# EAGLE design telekarte (EAGLE 6.3)
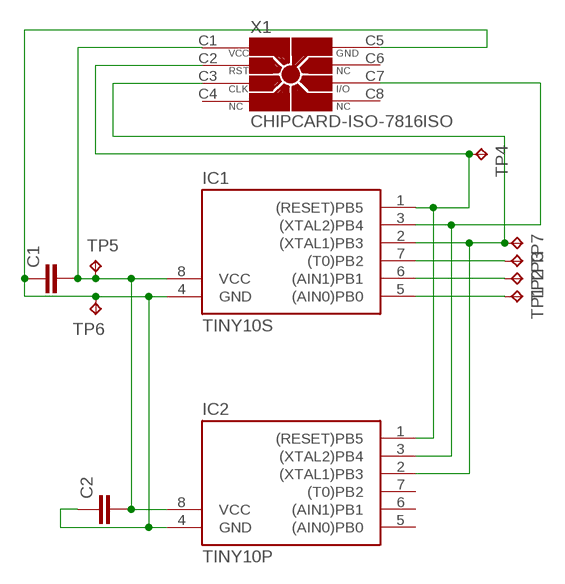
[diagram p0: schematic, sheet 1]

## Parts
C1  C-EUC0805  [C0805]
C2  C-EUC0805  [C0805]
IC1  TINY10S  [SO08]
IC2  TINY10P  [DIL08]
TP1  TPTP10SQ  [TP10SQ]
TP2  TPTP10SQ  [TP10SQ]
TP3  TPTP10SQ  [TP10SQ]
TP4  TPTP10SQ  [TP10SQ]
TP5  TPTP10SQ  [TP10SQ]
TP6  TPTP10SQ  [TP10SQ]
TP7  TPTP10SQ  [TP10SQ]
X1  CHIPCARD-ISO-7816ISO  [ISO-7816]

## Nets
CLK: IC1.2((XTAL1)PB3) IC2.2((XTAL1)PB3) TP7.TP X1.C3(CLK)
DAT: IC1.3((XTAL2)PB4) IC2.3((XTAL2)PB4) X1.C7(I/O)
GND: C1.1 C2.1 IC1.4(GND) IC2.4(GND) TP6.TP X1.C5(GND)
PB0: IC1.5((AIN0)PB0) TP1.TP
PB1: IC1.6((AIN1)PB1) TP2.TP
PB2: IC1.7((T0)PB2) TP3.TP
RST: IC1.1((RESET)PB5) IC2.1((RESET)PB5) TP4.TP X1.C2(RST)
VCC: C1.2 C2.2 IC1.8(VCC) IC2.8(VCC) TP5.TP X1.C1(VCC)
Unconnected: IC2.5((AIN0)PB0) IC2.6((AIN1)PB1) IC2.7((T0)PB2) X1.C4(NC) X1.C6(NC) X1.C8(NC)

## Library data of the parts
C1 C2 = resistor:C-EU: CAPACITOR, European symbol
IC1 IC2 = atmel:TINY10: MICROCONTROLLER 1 Kbytes ROM
TP1-TP7 = testpad:TP: Test pad
X1 = con-chipcard-iso7816:CHIPCARD-ISO-7816: Chip card connector ISO 7816; OC_FARNELL: unknown; OC_NEWARK: unknown

## Board
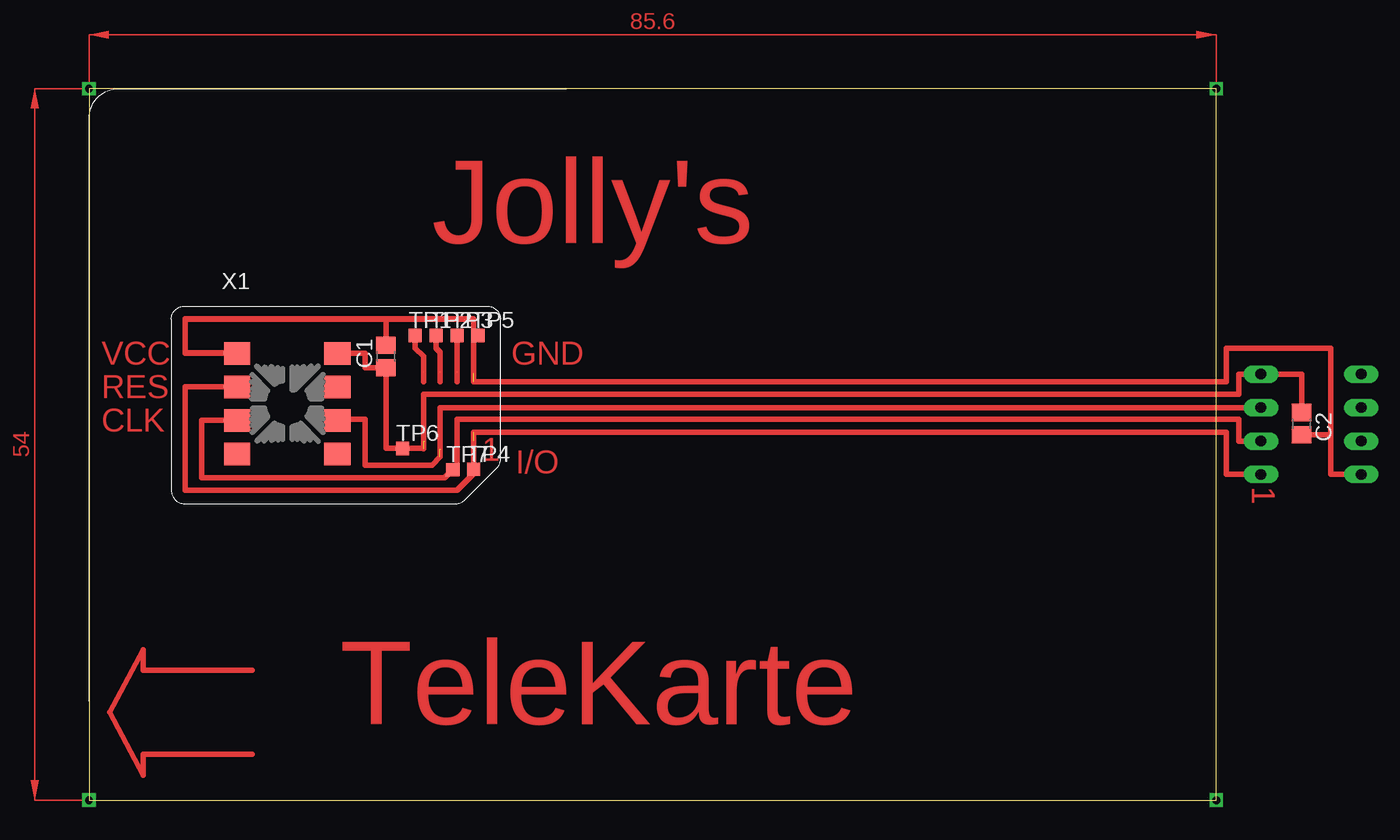
[diagram p1: board, top side]
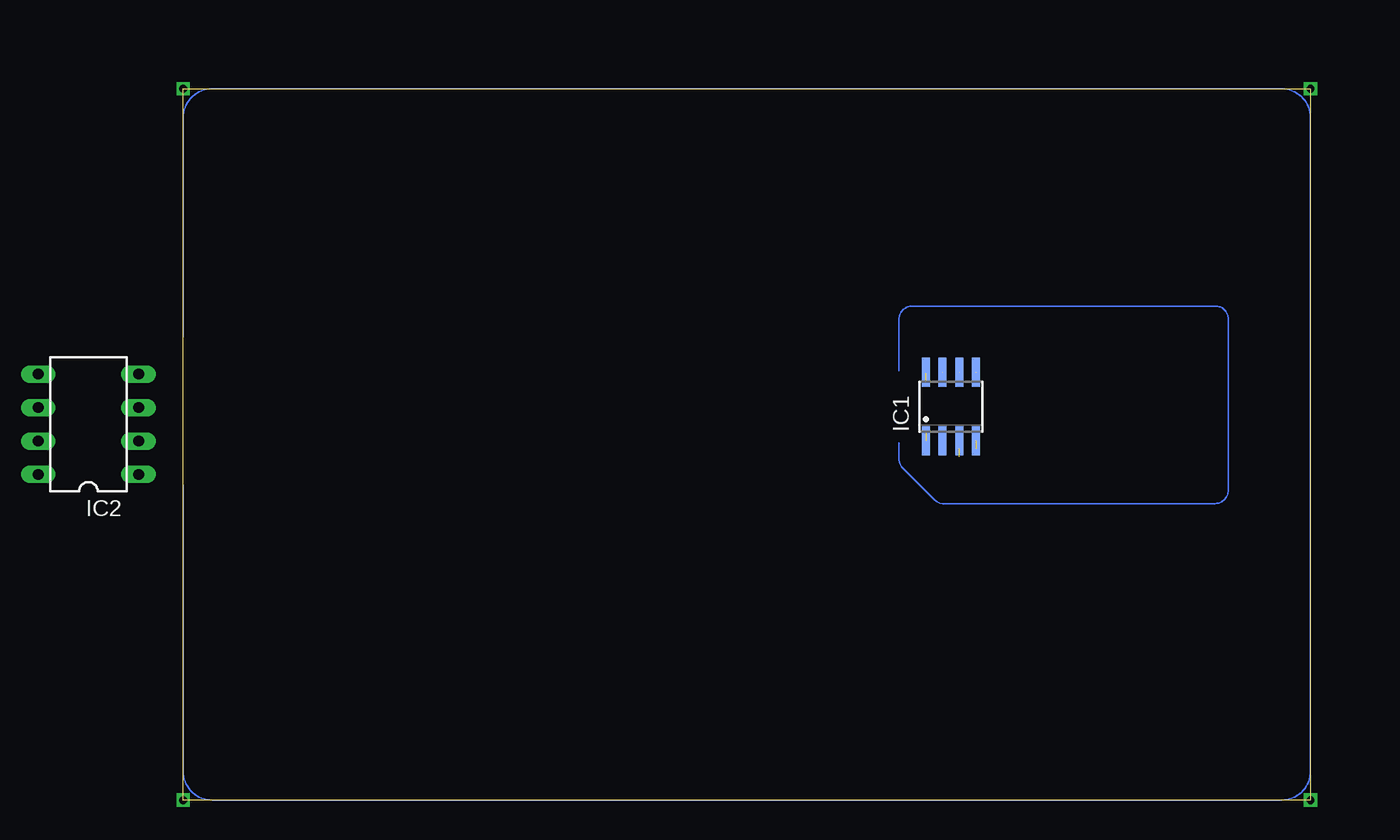
[diagram p2: board, bottom side, seen from below]

Size 85.6 x 54 mm. Coordinates in mm from the lower left corner, seen from the top.
Outline: 0,0 85.6,0 85.6,54 0,54 0,0
Copper layers (1*16): Top 0.035mm / dielectric 1.5mm / Bottom 0.035mm
Design rules "default": minimum track width 10mil, minimum drill 24mil, track to track 8mil, track to pad 8mil, pad to pad 8mil, via to via 8mil, smd to smd 8mil, copper to edge 40mil, drill to drill 8mil, minimum pad ring 10mil, minimum via ring 8mil, stop-mask expansion 4mil, vias tented up to drill 0mil, thermal gap 10mil

### Footprints (pad centres in the part's own frame; a part is rotated, then mirrored left to right if it is on the bottom)
C0805 = smd 1.3 x 1.5: 1 -0.85,0; 2 0.85,0
SO08 = smd 0.6 x 2.2: 1 -1.905,-2.6; 2 -0.635,-2.6; 3 0.635,-2.6; 4 1.905,-2.6; 5 1.905,2.6; 6 0.635,2.6; 7 -0.635,2.6; 8 -1.905,2.6
DIL08 = drill 0.813 long: 1 -3.81,-3.81; 2 -1.27,-3.81; 3 1.27,-3.81; 4 3.81,-3.81; 5 3.81,3.81; 6 1.27,3.81; 7 -1.27,3.81; 8 -3.81,3.81
TP10SQ = smd 1 x 1: TP 0,0
ISO-7816 = smd 2 x 1.7: C1 11.249,-20.099; C2 11.249,-22.638; C3 11.249,-25.183; C4 11.249,-27.722; C5 18.872,-20.1; C6 18.872,-22.64; C7 18.872,-25.18; C8 18.872,-27.722

### Placement (x,y rotation side)
C1  22.54,33.68 90 top
C2  92.08,28.57 270 top  (outside the outline)
IC1  27.3,29.87 0 bottom
IC2  92.8,28.52 90 bottom  (outside the outline)
TP1  24.77,35.27 0 top
TP2  26.35,35.27 0 top
TP3  27.94,35.27 0 top
TP4  29.21,25.11 0 top
TP5  29.53,35.27 0 top
TP6  23.81,26.7 0 top
TP7  27.62,25.08 0 top
X1  0,54 0 top

### Tracks (layer width: path | path; a pad name or v marks a point on that pad's centre or on a via)
CLK
  Top 0.406: X1.C3 8.57,28.82 8.57,24.47 26.99,24.47 27.45,24.94 | 27.45,24.94 27.94,25.43 IC1.2 27.94,28.89 87.31,28.89 87.31,27.25 IC2.2 | TP7.TP 27.45,25.08 27.45,24.94
DAT  (1 unrouted)
  Top 0.406: 88.9,29.84 88.9,29.76 IC2.3 26.67,29.8 26.67,26.06 26.04,25.43 20.95,25.43 20.95,28.89 18.87,28.89 X1.C7
  Bottom 0.406: 26.67,27.3 IC1.3 26.67,26.67
GND  (2 unrouted)
  Top 0.406: X1.C5 20.95,33.9 20.95,32.83 C1.1 22.54,26.7 TP6.TP 25.38,26.7 arc-90 25.4,26.67 25.4,30.8 87.31,30.8 87.31,32.34 IC2.4 92.08,32.34 C2.1
  Bottom 0.406: 25.4,27.62 IC1.4
N$1
  Top 0.406: 12.38,9.84 4.13,9.84 4.13,11.43 1.59,6.67 4.13,1.91 4.13,3.49 12.38,3.49
N$2
  Top 0.406: 25.4,31.75 25.4,32.38
N$3
  Top 0.406: 26.67,31.75 26.67,32.38
N$4
  Top 0.406: 27.94,31.75 27.94,32.38
N$9  (via drill 0.6 pad 0.25)
  other vias: 0,54
N$10  (via drill 0.6 pad 0.25)
  other vias: 0,0
N$11  (via drill 0.6 pad 0.25)
  other vias: 85.6,54
N$12  (via drill 0.6 pad 0.25)
  other vias: 85.6,0
N$13
  Bottom 0.1: 85.6,23.93 85.6,2.2 arc-90 83.4,0 2.2,0 arc-90 0,2.2 0,51.8 arc-90 2.2,54 83.4,54 arc-90 85.6,51.8 85.6,35.15
N$16
  Bottom 0.1: 31.24,25.84 31.21,25.65 31.15,25.46 31.05,25.3 28.54,22.8 28.35,22.64 28.13,22.54 27.94,22.51 7.24,22.51 arc-90 6.25,23.5 6.25,36.54 arc-90 7.21,37.5 30.26,37.5 arc-90 31.24,36.51
N$17
  Bottom 0.1: 31.24,36.48 31.24,32.58
N$18
  Bottom 0.1: 31.24,25.84 31.24,27.11
PB0  (1 unrouted)
  Top 0.406: TP1.TP 24.77,34.31 25.4,33.68 IC1.5
PB1  (1 unrouted)
  Top 0.406: TP2.TP 26.35,34.31 26.67,34 IC1.6
PB2  (1 unrouted)
  Top 0.406: TP3.TP IC1.7
RST  (2 unrouted)
  Top 0.406: X1.C2 7.3,31.36 7.3,23.52 27.96,23.52 29.21,24.77 TP4.TP 29.21,27.94 86.36,27.94 86.36,24.71 IC2.1
VCC  (1 unrouted)
  Top 0.406: X1.C1 7.3,33.9 7.3,33.97 | 7.3,36.51 7.3,36.54 22.54,36.54 | 22.54,36.54 29.21,36.54 29.21,36.51 | 29.21,35.27 29.21,31.75 86.36,31.75 86.36,34.29 94.3,34.29 94.3,27.73 | C1.2 22.54,36.54 | TP5.TP 29.21,35.27 | IC2.8 94.3,24.71 94.3,27.73 | C2.2 94.3,27.73 | 29.21,35.27 29.21,36.51 | 29.21,36.51 7.3,36.51 | 7.3,36.51 7.3,33.97 | 7.3,33.97 11.31,33.97
  Bottom 0.406: IC1.8 29.21,32.38
(copper drawn outside any net)
  shapes: Top area x2

### Text on the board
Top: Jolly's | VCC | GND | RES | CLK | 1 | I/O | 1 | TeleKarte